# EAGLE design main (EAGLE 9.1.0)
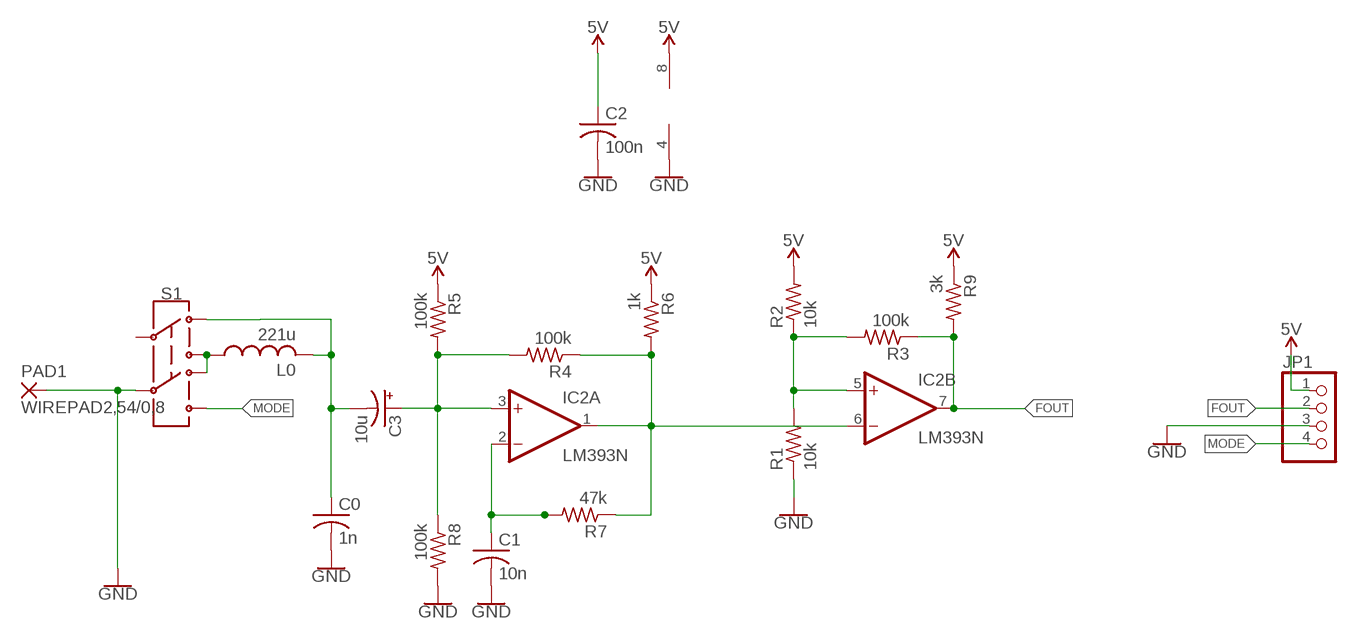
[diagram p0: schematic, sheet 1]

## Parts
C0  1n  C-US025-025X050  [C025-025X050]
C1  10n  C-US025-025X050  [C025-025X050]
C2  100n  C-US025-025X050  [C025-025X050]
C3  10u  CPOL-USE2.5-6  [E2,5-6]
IC2  LM393N  [DIL08]
JP1  PINHD-1X4  [1X04]
L0  221u  L-US0204/5  [0204/5]
PAD1  WIREPAD2,54/0,8  [2,54/0,8]
R1  10k  R-US_0204/7  [0204/7]
R2  10k  R-US_0207/10  [0207/10]
R3  100k  R-US_0207/10  [0207/10]
R4  100k  R-US_0207/10  [0207/10]
R5  100k  R-US_0207/10  [0207/10]
R6  1k  R-US_0207/10  [0207/10]
R7  47k  R-US_0207/10  [0207/10]
R8  100k  R-US_0207/10  [0207/10]
R9  3k  R-US_0207/10  [0207/10]
S1  SWITCH-DPDT-PTH-GPI-152-3013  [SWITCH_DPDT_PTH_GPI-152-3013]

## Nets
5V: C2.1 IC2.8(P:V+) JP1.1 R2.2 R5.1 R6.1 R9.1
FOUT: IC2.7(B:OUT) JP1.2 R3.1 R9.2
GND: C0.2 C1.2 C2.2 IC2.4(P:V-) JP1.3 PAD1.1(P) R1.1 R8.2 S1.C@2
MODE: JP1.4 S1.21
N$1: C1.1 IC2.2(A:-IN) R7.2
N$2: C3.+ IC2.3(A:+IN) R4.2 R5.2 R8.1
N$3: IC2.1(A:OUT) IC2.6(B:-IN) R4.1 R6.2 R7.1
N$6: IC2.5(B:+IN) R1.2 R2.1 R3.2
N$7: C0.1 C3.- L0.2 S1.10
N$9: L0.1 S1.11 S1.20
Unconnected: S1.C@1

## Library data of the parts
C0 C1 C2 = rcl:C-US: CAPACITOR, American symbol; SPICEPREFIX: C
C3 = rcl:CPOL-US: POLARIZED CAPACITOR, American symbol; SPICEPREFIX: C
IC2 = linear:LM393: COMPARATOR
JP1 = pinhead:PINHD-1X4: PIN HEADER
L0 = rcl:L-US: INDUCTOR, American symbol; SPICEPREFIX: L
PAD1 = wirepad:WIREPAD: Wire PAD connect wire on PCB
R1-R9 = rcl:R-US_: RESISTOR, American symbol; SPICEPREFIX: R
S1 = SparkFun-Switches:SWITCH-DPDT: Double-Pole, Double-Throw (DPDT) Switch Double-pole, double-throw switches. Variant Overview PTH-GPI-152-3013 Used on SparkFun Geiger Counter <https://www.sparkfun.com/products/11345> SMD-AY0202 Surface Mount DPDT Switch <https://www.sparkfun.com/products/597> (COM-00597) Used on e.g. LilyPad Arduino USB - ATmega32U4 Board <https://www.sparkfun.com/products/12049>; PROD_ID: SWCH-10554

## Board
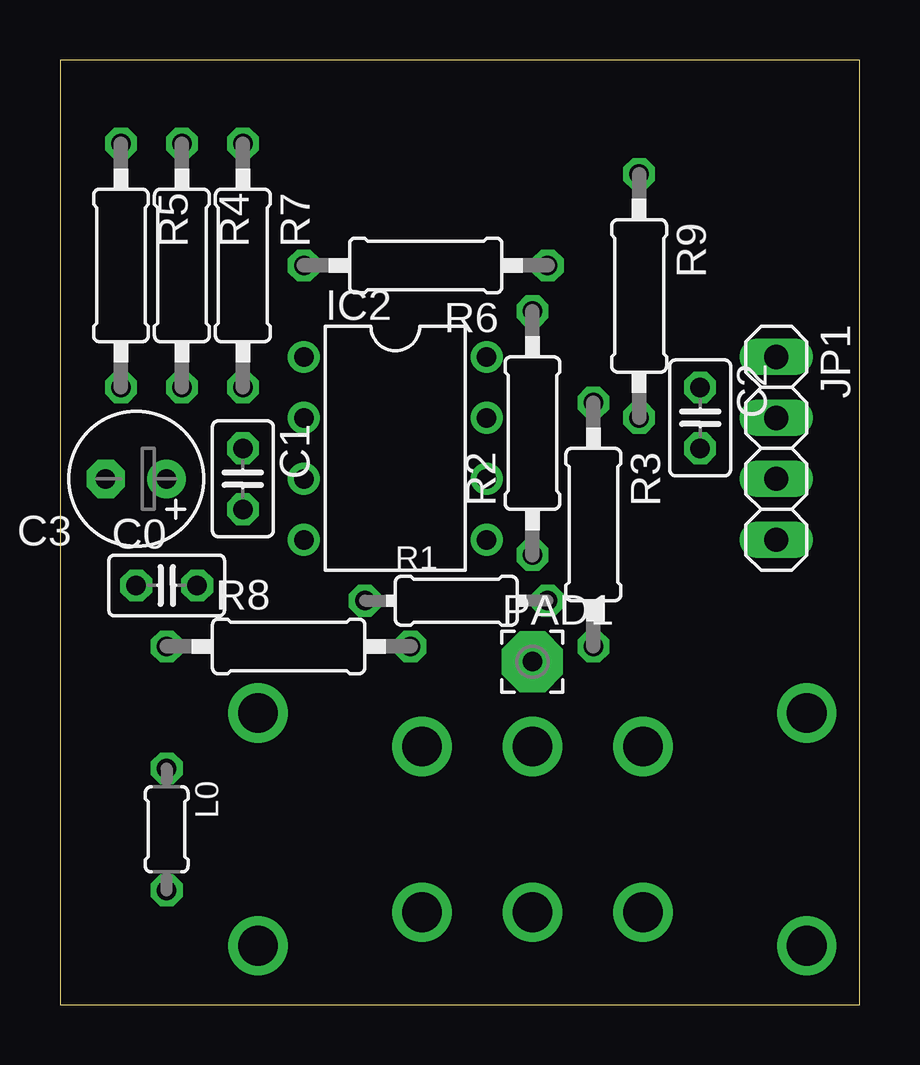
[diagram p1: board, top side]
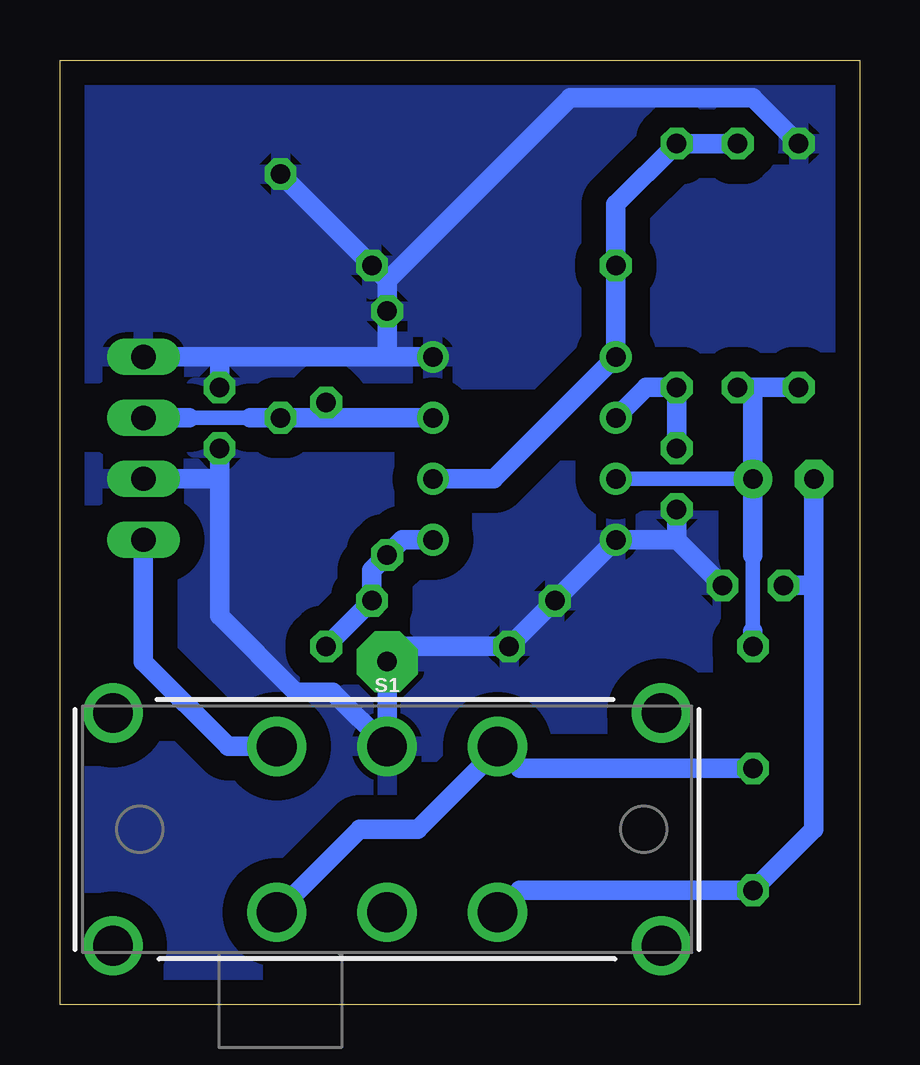
[diagram p2: board, bottom side, seen from below]

Size 33.32 x 39.36 mm. Coordinates in mm from the lower left corner, seen from the top.
Outline: 0,0 33.32,0 33.32,39.36 0,39.36 0,0
Copper layers (1*16): Top 0.035mm / dielectric 1.5mm / Bottom 0.035mm
Design rules "default": minimum track width 6mil, minimum drill 0.35mm, track to track 6mil, track to pad 6mil, pad to pad 6mil, via to via 6mil, smd to smd 6mil, copper to edge 40mil, drill to drill 6mil, minimum pad ring 10mil, minimum via ring 8mil, stop-mask expansion 4mil, vias tented up to drill 0mil, thermal gap 10mil

### Footprints (pad centres in the part's own frame; a part is rotated, then mirrored left to right if it is on the bottom)
C025-025X050 = drill 0.813 octagon: 1 -1.27,0; 2 1.27,0
E2,5-6 = drill 0.813 pad 1.6: + -1.27,0 | drill 0.813 pad 1.6 octagon: - 1.27,0
DIL08 = drill 0.813 pad 1.27: 1 -3.81,-3.81; 2 -1.27,-3.81; 3 1.27,-3.81; 4 3.81,-3.81; 5 3.81,3.81; 6 1.27,3.81; 7 -1.27,3.81; 8 -3.81,3.81
1X04 = drill 1.016 long: 1 -3.81,0; 2 -1.27,0; 3 1.27,0; 4 3.81,0
0204/5 = drill 0.813 octagon: 1 -2.54,0; 2 2.54,0
2,54/0,8 = drill 0.813 pad 2.54 octagon: 1 0,0
0204/7 = drill 0.813 octagon: 1 -3.81,0; 2 3.81,0
0207/10 = drill 0.813 octagon: 1 -5.08,0; 2 5.08,0
SWITCH_DPDT_PTH_GPI-152-3013 = drill 1.65: 10 -4.6,3.455; 11 -4.6,-3.455; 20 4.6,3.455; 21 4.6,-3.455; C@1 0,3.455; C@2 0,-3.455; P$7 11.43,4.85; P$8 -11.43,4.85; P$9 -11.43,-4.85; P$10 11.43,-4.85

### Placement (x,y rotation side)
C0  4.45,17.46 0 top
C1  7.62,21.91 270 top
C2  26.67,24.45 270 top
C3  3.18,21.91 180 top
IC2  13.97,23.18 270 top
JP1  29.85,23.18 270 top
L0  4.45,7.3 270 top
PAD1  19.68,14.29 0 top
R1  16.51,16.83 0 top
R2  19.68,23.81 90 top
R3  22.22,20 270 top
R4  5.08,30.8 270 top
R5  2.54,30.8 270 top
R6  15.24,30.8 180 top
R7  7.62,30.8 270 top
R8  9.53,14.92 0 top
R9  24.13,29.53 270 top
S1  19.68,7.3 180 bottom

### Tracks (layer width: path | path; a pad name or v marks a point on that pad's centre or on a via)
5V
  Bottom 0.813: JP1.1 26.67,26.99 | 26.67,26.99 19.68,26.99 | 19.68,26.99 IC2.8 | C2.1 26.67,26.99 | 19.68,26.99 R2.2 19.68,30.16 | 19.68,30.16 R6.1 R9.1 | R5.1 4.45,37.78 12.07,37.78 19.68,30.16
  pour Bottom (isolate 1.016): 0.32,39.37 33.34,39.37 33.34,26.04 0.32,26.04
FOUT
  Bottom 0.61: 25.4,24.45 27.94,24.45
  Bottom 0.813: IC2.7 22.22,24.45 | 22.22,24.45 R9.2 25.4,24.45 | 27.94,24.45 JP1.2 | R3.1 22.22,24.45
GND
  Bottom 0.813: C0.2 7.62,19.37 | 7.62,19.37 IC2.4 R1.1 R8.2 19.05,14.92 PAD1.1 S1.C@2 21.94,13.02 23.5,13.02 26.67,16.19 26.67,21.91 | C1.2 7.62,19.37 | 26.67,21.91 C2.2 | JP1.3 26.67,21.91
  pour Bottom (isolate 1.016): 0.32,24.45 33.34,24.45 33.34,0 0.32,0
MODE
  Bottom 0.813: S1.21 26.32,10.76 29.85,14.29 JP1.4
N$1
  Bottom 0.813: C1.1 R7.2 8.89,25.72 IC2.2
N$2
  Bottom 0.61: IC2.3 C3.+ | 4.45,15.56 4.45,18.73
  Bottom 0.813: R5.2 4.45,25.72 | 4.45,25.72 R4.2 | 4.45,25.72 C3.+ 4.45,18.73 | R8.1 4.45,15.56
N$3
  Bottom 0.813: IC2.6 15.24,21.91 IC2.1 R6.2 10.16,33.34 R7.1 R4.1
N$6
  Bottom 0.813: IC2.5 19.05,19.37 R2.1 20.32,18.1 R1.2 R3.2
N$7
  Bottom 0.813: S1.10 14.17,4.76 L0.2 1.9,7.3 1.9,17.46 | C0.1 1.9,17.46 | 1.9,17.46 C3.-
N$9
  Bottom 0.813: L0.1 14.17,9.84 15.02,10.7 | 15.02,10.7 S1.11 | S1.20 20.83,7.3 18.41,7.3 15.02,10.7